# EAGLE design ALU_roll (EAGLE 5.11)
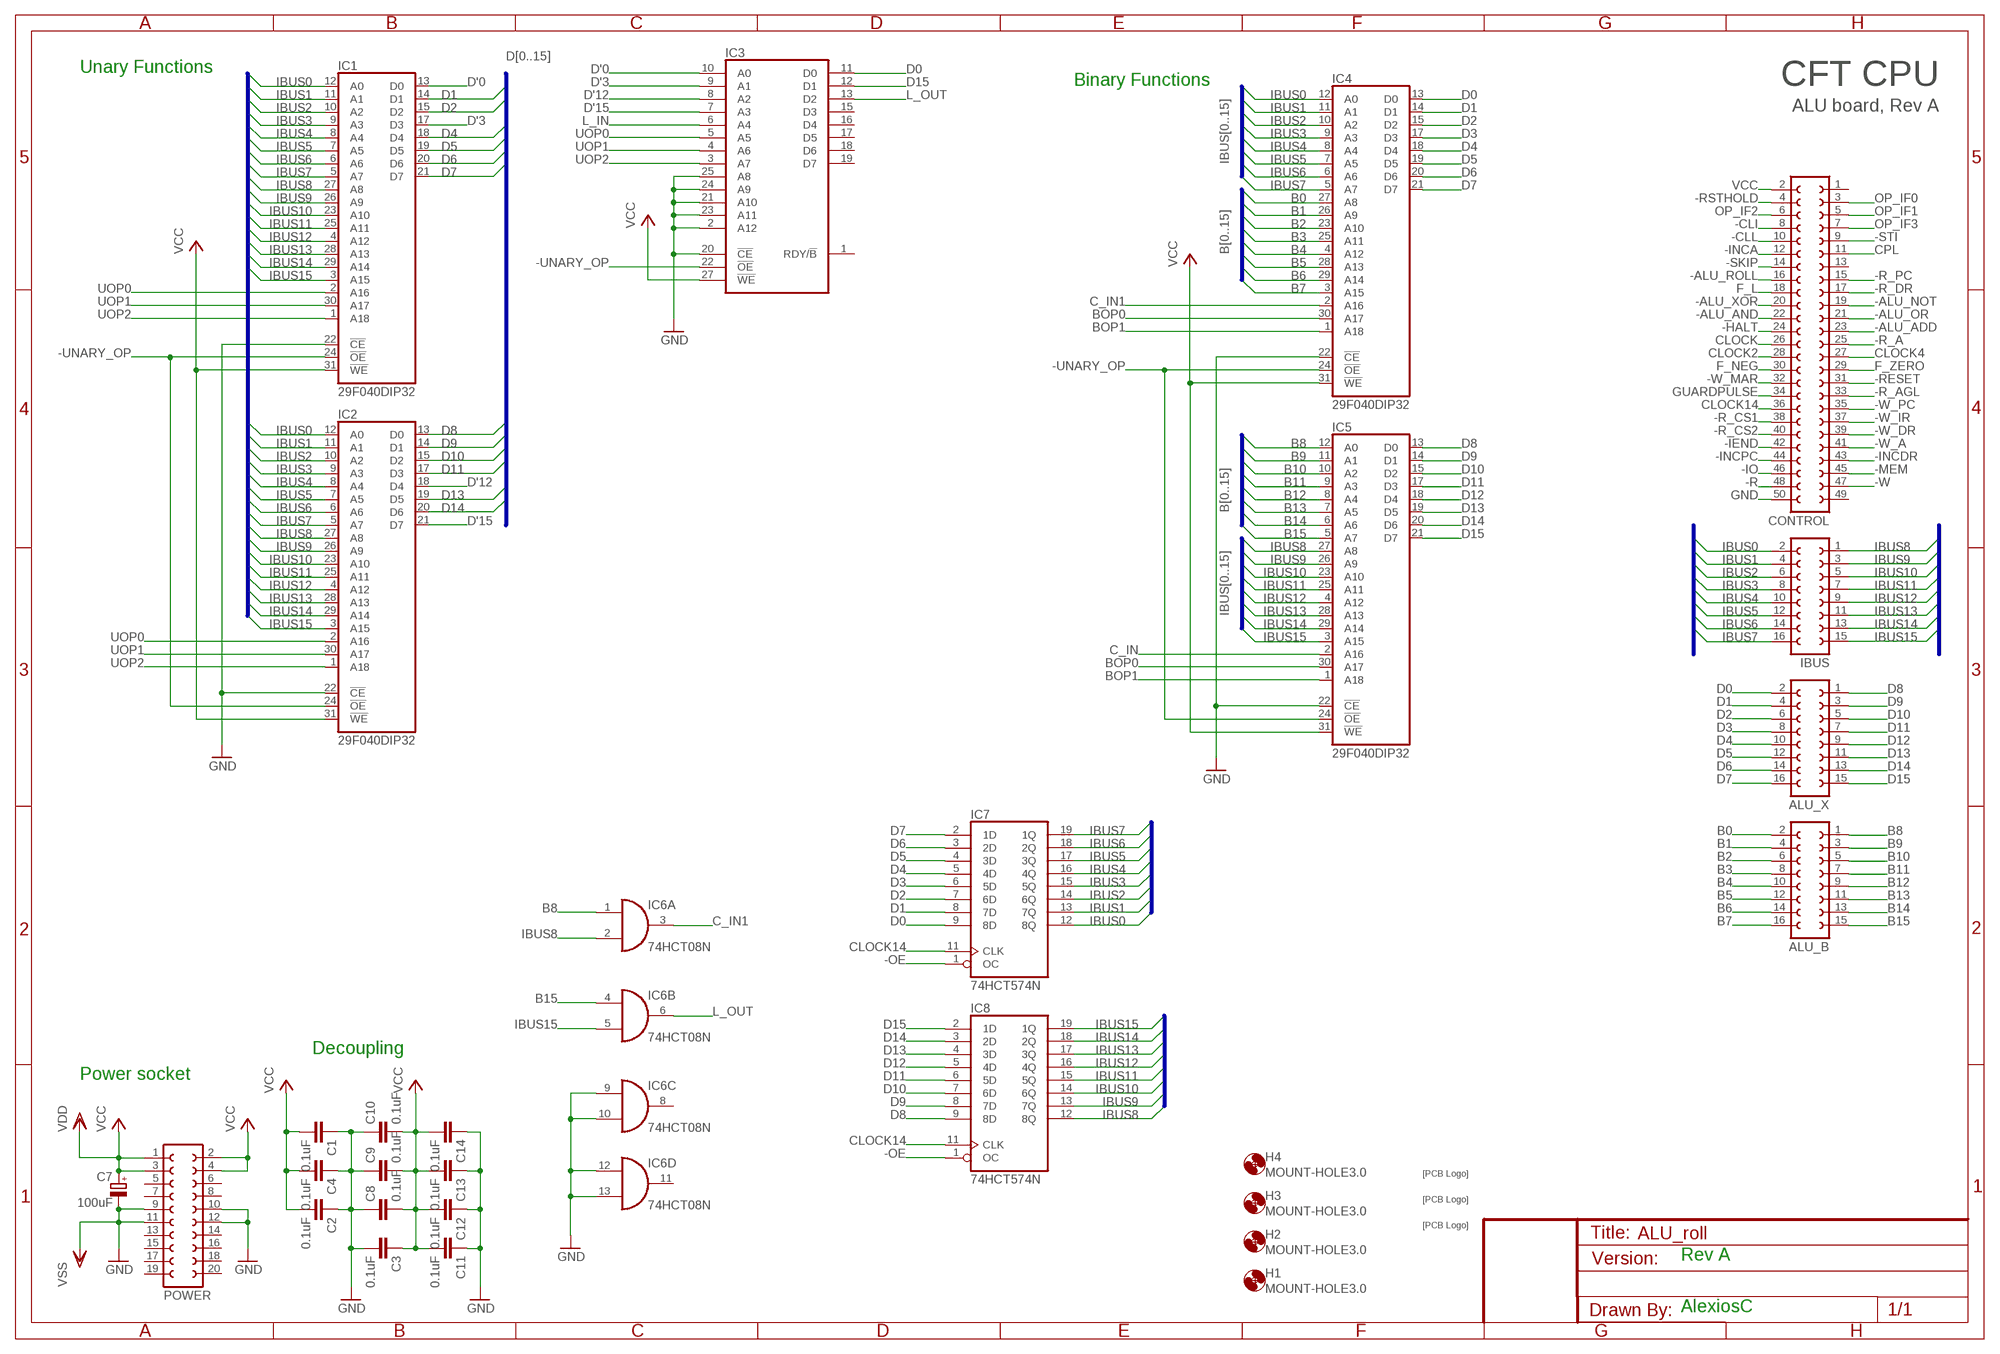
[diagram p0: schematic, sheet 1]

## Parts
ALU_B  FE08-2  [FE08-2]
ALU_X  FE08-2  [FE08-2]
C1  0.1uF  C-EU025-025X050  [C025-025X050]
C2  0.1uF  C-EU025-025X050  [C025-025X050]
C3  0.1uF  C-EU025-025X050  [C025-025X050]
C4  0.1uF  C-EU025-025X050  [C025-025X050]
C7  100uF  CPOL-EUE2.5-6  [E2,5-6]
C8  0.1uF  C-EU025-025X050  [C025-025X050]
C9  0.1uF  C-EU025-025X050  [C025-025X050]
C10  0.1uF  C-EU025-025X050  [C025-025X050]
C11  0.1uF  C-EU025-025X050  [C025-025X050]
C12  0.1uF  C-EU025-025X050  [C025-025X050]
C13  0.1uF  C-EU025-025X050  [C025-025X050]
C14  0.1uF  C-EU025-025X050  [C025-025X050]
CONTROL  FE25-2  [FE25-2]
H1  MOUNT-HOLE3.0  [3,0]
H2  MOUNT-HOLE3.0  [3,0]
H3  MOUNT-HOLE3.0  [3,0]
H4  MOUNT-HOLE3.0  [3,0]
IBUS  FE08-2  [FE08-2]
IC1  29F040DIP32  [DIL32]
IC2  29F040DIP32  [DIL32]
IC3  2864  [DIL28]
IC4  29F040DIP32  [DIL32]
IC5  29F040DIP32  [DIL32]
IC6  74HCT08N  [DIL14]
IC7  74HCT574N  [DIL20]
IC8  74HCT574N  [DIL20]
POWER  FE10-2  [FE10-2]
U$1  SIGNATUREPLANE  [SIGNATURE_PLANE]
U$2  SIGNATUREPLANE  [SIGNATURE_PLANE]
U$3  SIGNATURESILK  [SIGNATURE]

## Nets
-ALU_ADD: CONTROL.23
-ALU_AND: CONTROL.22
-ALU_NOT: CONTROL.19
-ALU_OR: CONTROL.21
-ALU_ROLL: CONTROL.16
-ALU_XOR: CONTROL.20
-CLI: CONTROL.8
-CLL: CONTROL.10
-HALT: CONTROL.24
-IEND: CONTROL.42
-INCA: CONTROL.12
-INCDR: CONTROL.43
-INCPC: CONTROL.44
-IO: CONTROL.46
-MEM: CONTROL.45
-OE: IC7.1(OC) IC8.1(OC)
-R: CONTROL.48
-R_A: CONTROL.25
-R_AGL: CONTROL.33
-R_CS1: CONTROL.38
-R_CS2: CONTROL.40
-R_DR: CONTROL.17
-R_PC: CONTROL.15
-RESET: CONTROL.31
-RSTHOLD: CONTROL.4
-SKIP: CONTROL.14
-STI: CONTROL.9
-UNARY_OP: IC1.24(!OE) IC2.24(!OE) IC3.22(!OE) IC4.24(!OE) IC5.24(!OE)
-W: CONTROL.47
-W_A: CONTROL.41
-W_DR: CONTROL.39
-W_IR: CONTROL.37
-W_MAR: CONTROL.32
-W_PC: CONTROL.35
B0: ALU_B.2 IC4.27(A8)
B1: ALU_B.4 IC4.26(A9)
B2: ALU_B.6 IC4.23(A10)
B3: ALU_B.8 IC4.25(A11)
B4: ALU_B.10 IC4.4(A12)
B5: ALU_B.12 IC4.28(A13)
B6: ALU_B.14 IC4.29(A14)
B7: ALU_B.16 IC4.3(A15)
B8: ALU_B.1 IC5.12(A0) IC6.1(A:I0)
B9: ALU_B.3 IC5.11(A1)
B10: ALU_B.5 IC5.10(A2)
B11: ALU_B.7 IC5.9(A3)
B12: ALU_B.9 IC5.8(A4)
B13: ALU_B.11 IC5.7(A5)
B14: ALU_B.13 IC5.6(A6)
B15: ALU_B.15 IC5.5(A7) IC6.4(B:I0)
BOP0: IC4.30(A17) IC5.30(A17)
BOP1: IC4.1(A18) IC5.1(A18)
C_IN: IC5.2(A16)
C_IN1: IC4.2(A16) IC6.3(A:O)
CLOCK: CONTROL.26
CLOCK2: CONTROL.28
CLOCK4: CONTROL.27
CLOCK14: CONTROL.36 IC7.11(CLK) IC8.11(CLK)
CPL: CONTROL.11
D0: ALU_X.2 IC3.11(D0) IC4.13(D0) IC7.9(8D)
D1: ALU_X.4 IC1.14(D1) IC4.14(D1) IC7.8(7D)
D2: ALU_X.6 IC1.15(D2) IC4.15(D2) IC7.7(6D)
D3: ALU_X.8 IC4.17(D3) IC7.6(5D)
D4: ALU_X.10 IC1.18(D4) IC4.18(D4) IC7.5(4D)
D5: ALU_X.12 IC1.19(D5) IC4.19(D5) IC7.4(3D)
D6: ALU_X.14 IC1.20(D6) IC4.20(D6) IC7.3(2D)
D7: ALU_X.16 IC1.21(D7) IC4.21(D7) IC7.2(1D)
D8: ALU_X.1 IC2.13(D0) IC5.13(D0) IC8.9(8D)
D9: ALU_X.3 IC2.14(D1) IC5.14(D1) IC8.8(7D)
D10: ALU_X.5 IC2.15(D2) IC5.15(D2) IC8.7(6D)
D11: ALU_X.7 IC2.17(D3) IC5.17(D3) IC8.6(5D)
D12: ALU_X.9 IC5.18(D4) IC8.5(4D)
D13: ALU_X.11 IC2.19(D5) IC5.19(D5) IC8.4(3D)
D14: ALU_X.13 IC2.20(D6) IC5.20(D6) IC8.3(2D)
D15: ALU_X.15 IC3.12(D1) IC5.21(D7) IC8.2(1D)
D'0: IC1.13(D0) IC3.10(A0)
D'3: IC1.17(D3) IC3.9(A1)
D'12: IC2.18(D4) IC3.8(A2)
D'15: IC2.21(D7) IC3.7(A3)
F_L: CONTROL.18
F_NEG: CONTROL.30
F_ZERO: CONTROL.29
GND: C1.1 C2.1 C3.2 C4.1 C7.- C8.1 C9.1 C10.1 C11.1 C12.1 C13.1 C14.1 CONTROL.50 IC1.22(!CE) IC2.22(!CE) IC3.2(A12) IC3.20(!CE) IC3.21(A10) IC3.23(A11) IC3.24(A9) IC3.25(A8) IC4.22(!CE) IC5.22(!CE) IC6.9(C:I0) IC6.10(C:I1) IC6.12(D:I0) IC6.13(D:I1) POWER.9 POWER.10 POWER.11 POWER.12 ; supply symbol labelled VSS
GUARDPULSE: CONTROL.34
IBUS0: IBUS.2 IC1.12(A0) IC2.12(A0) IC4.12(A0) IC7.12(8Q)
IBUS1: IBUS.4 IC1.11(A1) IC2.11(A1) IC4.11(A1) IC7.13(7Q)
IBUS2: IBUS.6 IC1.10(A2) IC2.10(A2) IC4.10(A2) IC7.14(6Q)
IBUS3: IBUS.8 IC1.9(A3) IC2.9(A3) IC4.9(A3) IC7.15(5Q)
IBUS4: IBUS.10 IC1.8(A4) IC2.8(A4) IC4.8(A4) IC7.16(4Q)
IBUS5: IBUS.12 IC1.7(A5) IC2.7(A5) IC4.7(A5) IC7.17(3Q)
IBUS6: IBUS.14 IC1.6(A6) IC2.6(A6) IC4.6(A6) IC7.18(2Q)
IBUS7: IBUS.16 IC1.5(A7) IC2.5(A7) IC4.5(A7) IC7.19(1Q)
IBUS8: IBUS.1 IC1.27(A8) IC2.27(A8) IC5.27(A8) IC6.2(A:I1) IC8.12(8Q)
IBUS9: IBUS.3 IC1.26(A9) IC2.26(A9) IC5.26(A9) IC8.13(7Q)
IBUS10: IBUS.5 IC1.23(A10) IC2.23(A10) IC5.23(A10) IC8.14(6Q)
IBUS11: IBUS.7 IC1.25(A11) IC2.25(A11) IC5.25(A11) IC8.15(5Q)
IBUS12: IBUS.9 IC1.4(A12) IC2.4(A12) IC5.4(A12) IC8.16(4Q)
IBUS13: IBUS.11 IC1.28(A13) IC2.28(A13) IC5.28(A13) IC8.17(3Q)
IBUS14: IBUS.13 IC1.29(A14) IC2.29(A14) IC5.29(A14) IC8.18(2Q)
IBUS15: IBUS.15 IC1.3(A15) IC2.3(A15) IC5.3(A15) IC6.5(B:I1) IC8.19(1Q)
L_IN: IC3.6(A4)
L_OUT: IC3.13(D2) IC6.6(B:O)
OP_IF0: CONTROL.3
OP_IF1: CONTROL.5
OP_IF2: CONTROL.6
OP_IF3: CONTROL.7
UOP0: IC1.2(A16) IC2.2(A16) IC3.5(A5)
UOP1: IC1.30(A17) IC2.30(A17) IC3.4(A6)
UOP2: IC1.1(A18) IC2.1(A18) IC3.3(A7)
VCC: C1.2 C2.2 C3.1 C4.2 C7.+ C8.2 C9.2 C10.2 C11.2 C12.2 C13.2 C14.2 CONTROL.2 IC1.31(!WE) IC2.31(!WE) IC3.27(!WE) IC4.31(!WE) IC5.31(!WE) POWER.1 POWER.2 POWER.3 POWER.4 ; supply symbol labelled VDD
Unconnected: CONTROL.1 CONTROL.13 CONTROL.49 IC3.1(RDY/!B) IC3.15(D3) IC3.16(D4) IC3.17(D5) IC3.18(D6) IC3.19(D7) IC6.8(C:O) IC6.11(D:O) POWER.5 POWER.6 POWER.7 POWER.8 POWER.13 POWER.14 POWER.15 POWER.16 POWER.17 POWER.18 POWER.19 POWER.20

## Buses
IBUS[0..15]
D[0..15]
B[0..15]

## Notes on the sheet
- Unary Functions
- Binary Functions | CFT CPU
- ALU board, Rev A
- Decoupling
- Power socket
- Rev A
- AlexiosC

## Power pins joined to a net without a drawn wire
GND: IC1.16(GND) IC2.16(GND) IC3.14(GND) IC4.16(GND) IC5.16(GND) IC6.7(P:GND) IC7.10(GND) IC8.10(GND)
VCC: IC1.32(VCC) IC2.32(VCC) IC3.28(VCC) IC4.32(VCC) IC5.32(VCC) IC6.14(P:VCC) IC7.20(VCC) IC8.20(VCC)

## Library data of the parts
ALU_B ALU_X IBUS = con-lsta:FE08-2: FEMALE HEADER
C1-C4 C8-C14 = rcl:C-EU: CAPACITOR, European symbol
C7 = rcl:CPOL-EU: POLARIZED CAPACITOR, European symbol
CONTROL = con-lsta:FE25-2: FEMALE HEADER
H1-H4 = holes:MOUNT-HOLE: MOUNTING HOLE with drill center marker
IC1 IC2 IC4 IC5 = alexios:29F040: 4-mbit (512x8) Flash memory in a PLCC32 package (with socket). AM29F040 is an example of this.
IC3 = memory:2864: MEMORY
IC6 = 74xx-eu:74*08: Quad 2-input AND gate
IC7 IC8 = 74xx-eu:74*574: 8-bit D type FLIP FLOP bus driver
POWER = con-lsta:FE10-2: FEMALE HEADER; OC_FARNELL: unknown; OC_NEWARK: unknown
U$1-U$3 = alexios:SIGNATURE: Soup signature

## Net classes
1 Decoupling: width 1.27 mm

## Board
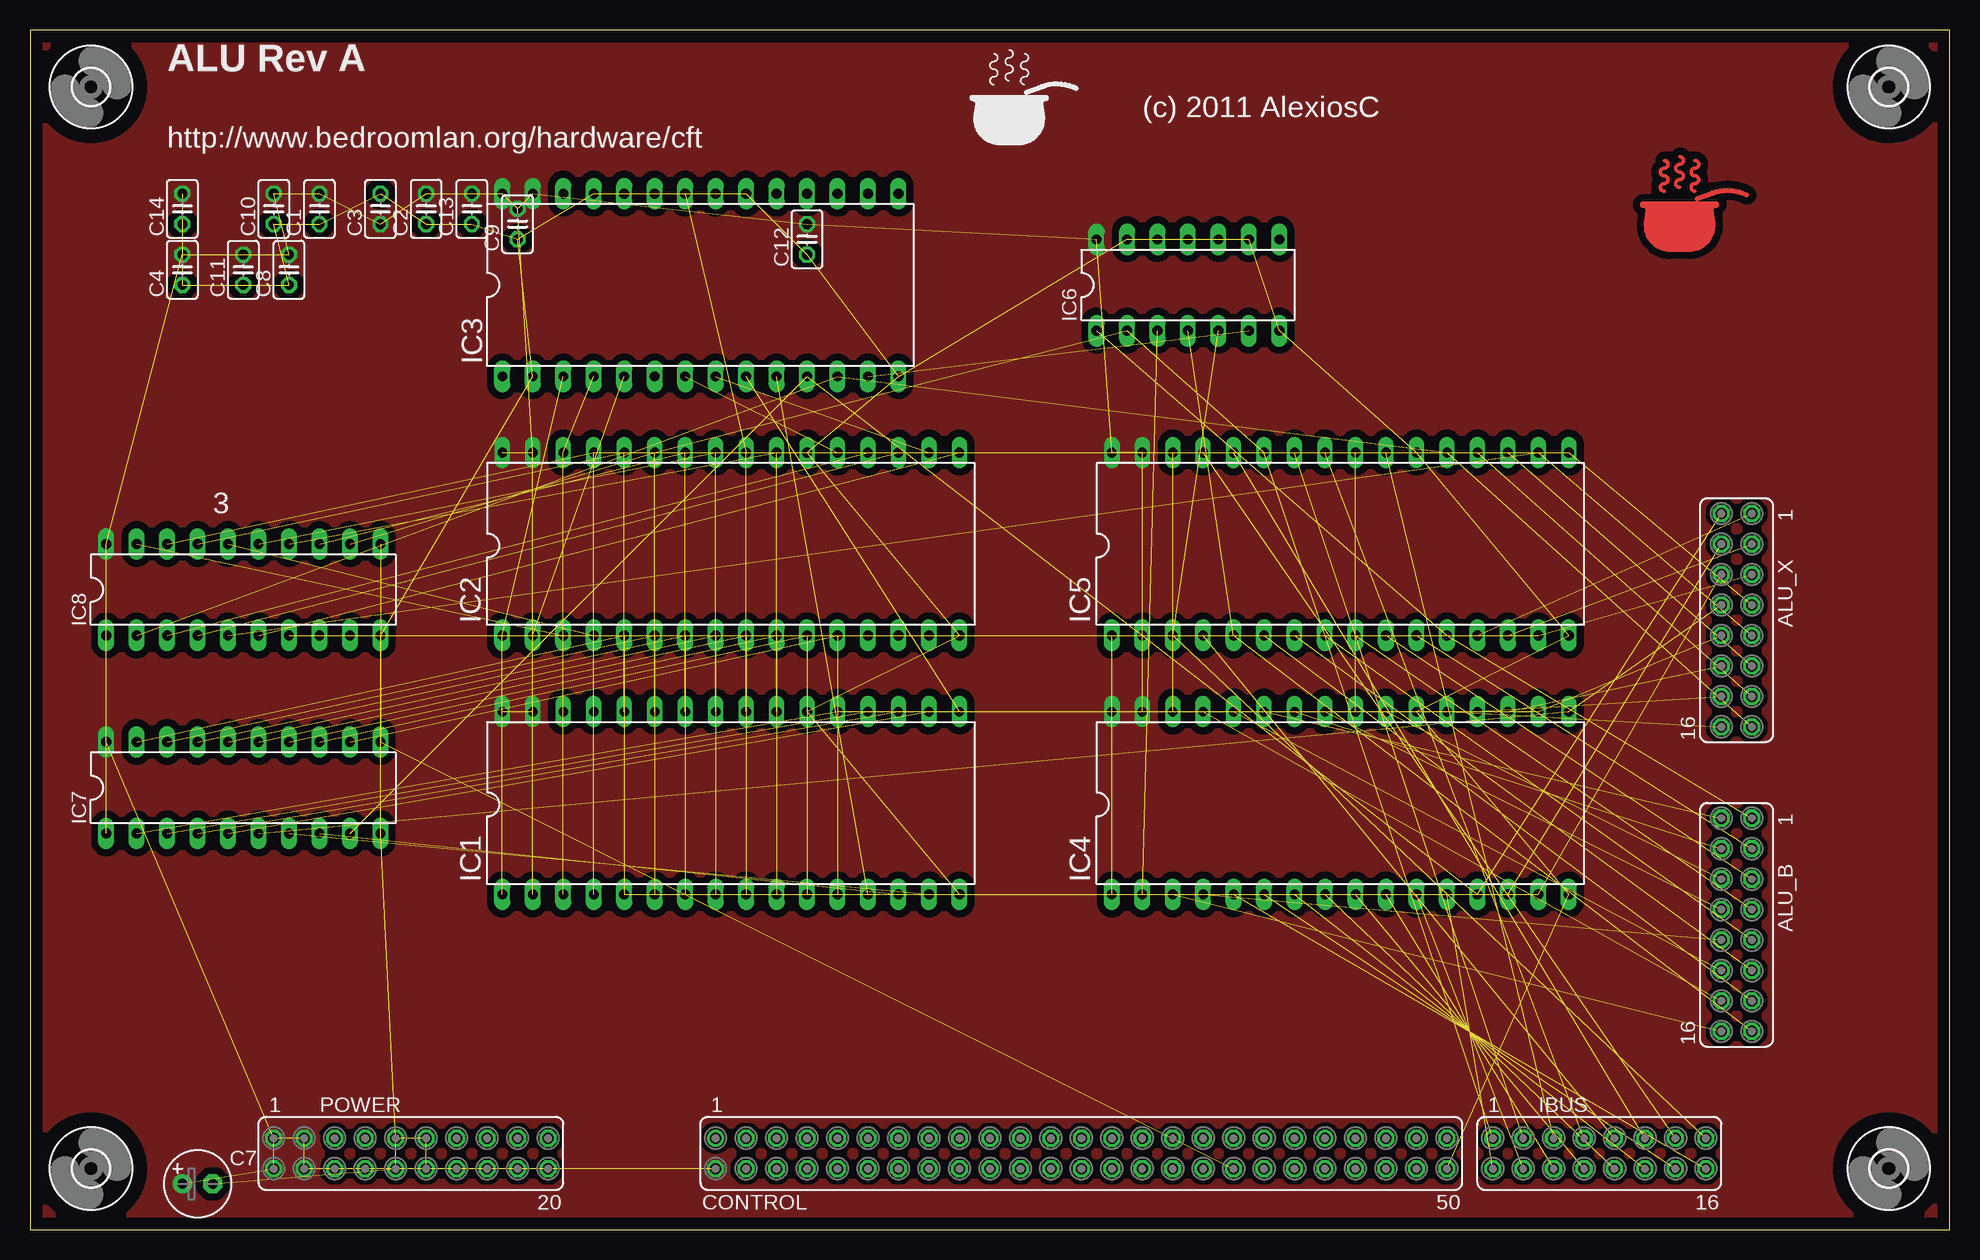
[diagram p1: board, top side]
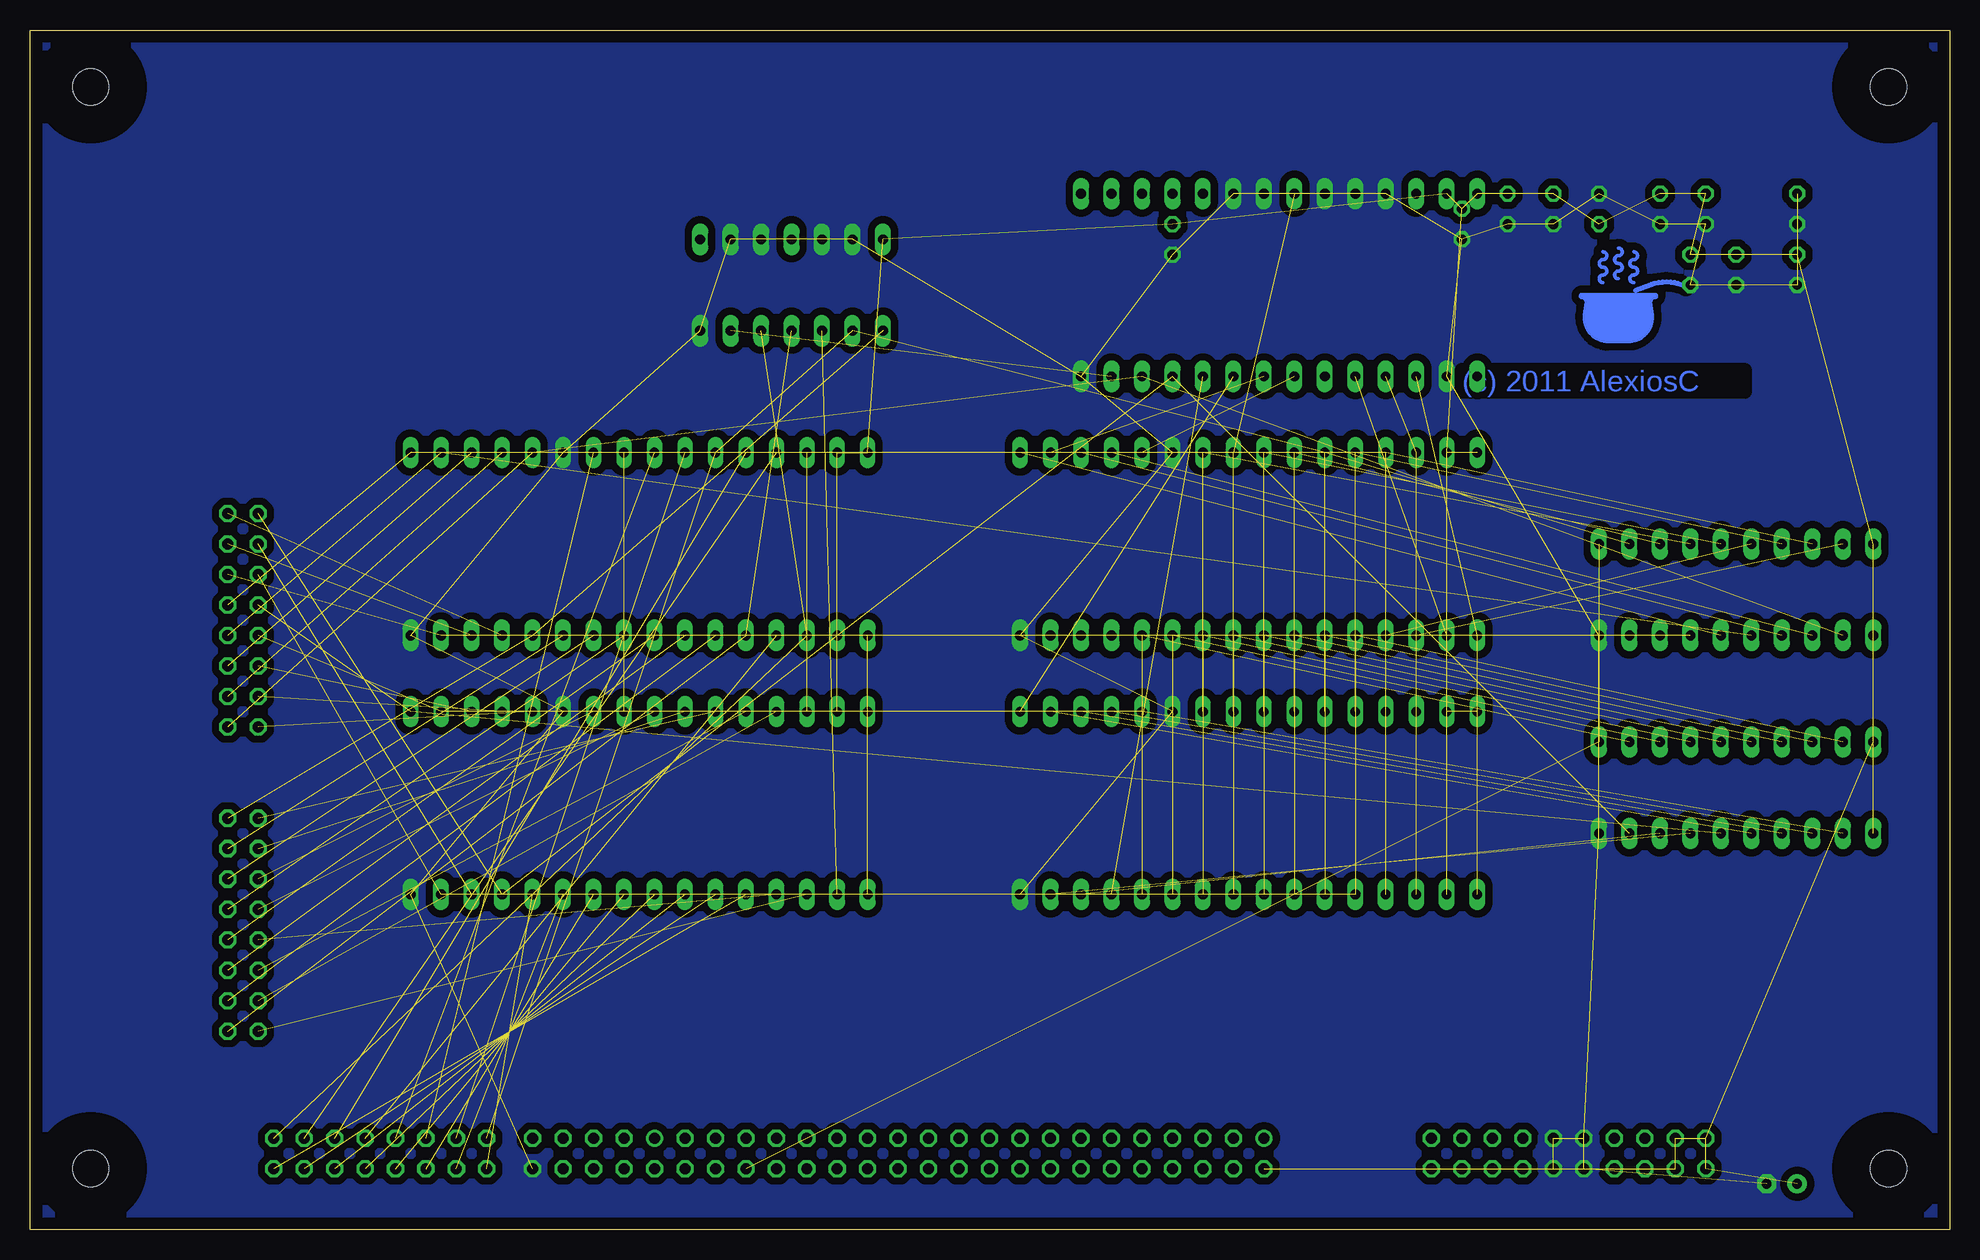
[diagram p2: board, bottom side, seen from below]

Size 160 x 100 mm. Coordinates in mm from the lower left corner, seen from the top.
Outline: 0,0 160,0 160,100 0,100 0,0
Copper layers (1*16): Top 0.035mm / dielectric 1.5mm / Bottom 0.035mm
Design rules "olimex-10mil": minimum track width 10mil, minimum drill 24mil, track to track 10mil, track to pad 10mil, pad to pad 10mil, via to via 10mil, smd to smd 10mil, copper to edge 40mil, drill to drill 10mil, minimum pad ring 10mil, minimum via ring 8mil, stop-mask expansion 0mil, vias tented up to drill 0mil, thermal gap 10mil

### Footprints (pad centres in the part's own frame; a part is rotated, then mirrored left to right if it is on the bottom)
FE08-2 = drill 0.914 octagon: 1 -8.89,1.27; 2 -8.89,-1.27; 3 -6.35,1.27; 4 -6.35,-1.27; 5 -3.81,1.27; 6 -3.81,-1.27; 7 -1.27,1.27; 8 -1.27,-1.27; 9 1.27,1.27; 10 1.27,-1.27; 11 3.81,1.27; 12 3.81,-1.27; 13 6.35,1.27; 14 6.35,-1.27; 15 8.89,1.27; 16 8.89,-1.27
C025-025X050 = drill 0.813 octagon: 1 -1.27,0; 2 1.27,0
E2,5-6 = drill 0.813 pad 1.6 round: + -1.27,0 | drill 0.813 pad 1.6 octagon: - 1.27,0
FE25-2 = drill 0.914 round: 1 -30.48,1.27; 41 20.32,1.27 | drill 0.914 octagon: 2 -30.48,-1.27; 3 -27.94,1.27; 4 -27.94,-1.27; 5 -25.4,1.27; 6 -25.4,-1.27; 7 -22.86,1.27; 8 -22.86,-1.27; 9 -20.32,1.27; 10 -20.32,-1.27; 11 -17.78,1.27; 12 -17.78,-1.27; 13 -15.24,1.27; 14 -15.24,-1.27; 15 -12.7,1.27; 16 -12.7,-1.27; 17 -10.16,1.27; 18 -10.16,-1.27; 19 -7.62,1.27; 20 -7.62,-1.27; 21 -5.08,1.27; 22 -5.08,-1.27; 23 -2.54,1.27; 24 -2.54,-1.27; 25 0,1.27; 26 0,-1.27; 27 2.54,1.27; 28 2.54,-1.27; 29 5.08,1.27; 30 5.08,-1.27; 31 7.62,1.27; 32 7.62,-1.27; 33 10.16,1.27; 34 10.16,-1.27; 35 12.7,1.27; 36 12.7,-1.27; 37 15.24,1.27; 38 15.24,-1.27; 39 17.78,1.27; 40 17.78,-1.27; 42 20.32,-1.27; 43 22.86,1.27; 44 22.86,-1.27; 45 25.4,1.27; 46 25.4,-1.27; 47 27.94,1.27; 48 27.94,-1.27; 49 30.48,1.27; 50 30.48,-1.27
3,0 = hole 3: 0,0
DIL32 = drill 0.813 long: 1 -19.05,-7.62; 2 -16.51,-7.62; 3 -13.97,-7.62; 4 -11.43,-7.62; 5 -8.89,-7.62; 6 -6.35,-7.62; 7 -3.81,-7.62; 8 -1.27,-7.62; 9 1.27,-7.62; 10 3.81,-7.62; 11 6.35,-7.62; 12 8.89,-7.62; 13 11.43,-7.62; 14 13.97,-7.62; 15 16.51,-7.62; 16 19.05,-7.62 | drill 0.8 long: 17 19.05,7.62; 18 16.51,7.62; 19 13.97,7.62; 20 11.43,7.62; 21 8.89,7.62; 22 6.35,7.62; 23 3.81,7.62; 24 1.27,7.62; 25 -1.27,7.62; 26 -3.81,7.62; 27 -6.35,7.62; 28 -8.89,7.62; 29 -11.43,7.62; 30 -13.97,7.62; 31 -16.51,7.62; 32 -19.05,7.62
DIL28 = drill 0.813 long: 1 -16.51,-7.62; 2 -13.97,-7.62; 3 -11.43,-7.62; 4 -8.89,-7.62; 5 -6.35,-7.62; 6 -3.81,-7.62; 7 -1.27,-7.62; 8 1.27,-7.62; 9 3.81,-7.62; 10 6.35,-7.62; 11 8.89,-7.62; 12 11.43,-7.62; 13 13.97,-7.62; 14 16.51,-7.62; 15 16.51,7.62; 16 13.97,7.62; 17 11.43,7.62; 18 8.89,7.62; 19 6.35,7.62; 20 3.81,7.62; 21 1.27,7.62; 22 -1.27,7.62; 23 -3.81,7.62; 24 -6.35,7.62; 25 -8.89,7.62; 26 -11.43,7.62; 27 -13.97,7.62; 28 -16.51,7.62
DIL14 = drill 0.813 long: 1 -7.62,-3.81; 2 -5.08,-3.81; 3 -2.54,-3.81; 4 0,-3.81; 5 2.54,-3.81; 6 5.08,-3.81; 7 7.62,-3.81; 8 7.62,3.81; 9 5.08,3.81; 10 2.54,3.81; 11 0,3.81; 12 -2.54,3.81; 13 -5.08,3.81; 14 -7.62,3.81
DIL20 = drill 0.813 long: 1 -11.43,-3.81; 2 -8.89,-3.81; 3 -6.35,-3.81; 4 -3.81,-3.81; 5 -1.27,-3.81; 6 1.27,-3.81; 7 3.81,-3.81; 8 6.35,-3.81; 9 8.89,-3.81; 10 11.43,-3.81; 11 11.43,3.81; 12 8.89,3.81; 13 6.35,3.81; 14 3.81,3.81; 15 1.27,3.81; 16 -1.27,3.81; 17 -3.81,3.81; 18 -6.35,3.81; 19 -8.89,3.81; 20 -11.43,3.81
FE10-2 = drill 0.914 octagon: 1 -11.43,1.27; 2 -11.43,-1.27; 3 -8.89,1.27; 4 -8.89,-1.27; 5 -6.35,1.27; 6 -6.35,-1.27; 7 -3.81,1.27; 8 -3.81,-1.27; 9 -1.27,1.27; 10 -1.27,-1.27; 11 1.27,1.27; 12 1.27,-1.27; 13 3.81,1.27; 14 3.81,-1.27; 15 6.35,1.27; 16 6.35,-1.27; 17 8.89,1.27; 18 8.89,-1.27; 19 11.43,1.27; 20 11.43,-1.27

### Placement (x,y rotation side)
ALU_B  142.24,25.4 270 top
ALU_X  142.24,50.8 270 top
C1  24.13,85.09 90 top
C2  33.02,85.09 90 top
C3  29.21,85.09 90 top
C4  12.7,80.01 90 top
C7  13.97,3.81 0 top
C8  21.59,80.01 90 top
C9  40.64,83.82 90 top
C10  20.32,85.09 90 top
C11  17.78,80.01 90 top
C12  64.77,82.55 90 top
C13  36.83,85.09 90 top
C14  12.7,85.09 90 top
CONTROL  87.63,6.35 0 top
H1  154.94,95.25 0 top
H2  154.94,5.08 0 top
H3  5.08,5.08 0 top
H4  5.08,95.25 0 top
IBUS  130.81,6.35 0 top
IC1  58.42,35.56 0 top
IC2  58.42,57.15 0 top
IC3  55.88,78.74 0 top
IC4  109.22,35.56 0 top
IC5  109.22,57.15 0 top
IC6  96.52,78.74 0 top
IC7  17.78,36.83 0 top
IC8  17.78,53.34 0 top
POWER  31.75,6.35 0 top
U$1  134.62,81.28 0 top
U$2  30.48,73.66 0 bottom
U$3  78.74,90.17 0 top

### Tracks (layer width: path | path; a pad name or v marks a point on that pad's centre or on a via)
-OE  (1 unrouted)
-UNARY_OP  (4 unrouted)
B0  (1 unrouted)
B1  (1 unrouted)
B2  (1 unrouted)
B3  (1 unrouted)
B4  (1 unrouted)
B5  (1 unrouted)
B6  (1 unrouted)
B7  (1 unrouted)
B8  (2 unrouted)
B9  (1 unrouted)
B10  (1 unrouted)
B11  (1 unrouted)
B12  (1 unrouted)
B13  (1 unrouted)
B14  (1 unrouted)
B15  (2 unrouted)
BOP0  (1 unrouted)
BOP1  (1 unrouted)
C_IN1  (1 unrouted)
CLOCK14  (2 unrouted)
D0  (3 unrouted)
D1  (3 unrouted)
D2  (3 unrouted)
D3  (2 unrouted)
D4  (3 unrouted)
D5  (3 unrouted)
D6  (3 unrouted)
D7  (3 unrouted)
D8  (3 unrouted)
D9  (3 unrouted)
D10  (3 unrouted)
D11  (3 unrouted)
D12  (2 unrouted)
D13  (3 unrouted)
D14  (3 unrouted)
D15  (3 unrouted)
D'0  (1 unrouted)
D'3  (1 unrouted)
D'12  (1 unrouted)
D'15  (1 unrouted)
GND  (38 unrouted)
  pour Bottom (isolate 0.508, no thermals): 30.48,8.89 29.21,7.62 29.21,5.08 30.48,3.81 33.02,3.81 34.29,5.08 34.29,7.62 33.02,8.89
  pour Bottom (isolate 0.61, no thermals): 0,100.33 0,0 160.02,0 160.02,100.33
IBUS0  (4 unrouted)
IBUS1  (4 unrouted)
IBUS2  (4 unrouted)
IBUS3  (4 unrouted)
IBUS4  (4 unrouted)
IBUS5  (4 unrouted)
IBUS6  (4 unrouted)
IBUS7  (4 unrouted)
IBUS8  (5 unrouted)
IBUS9  (4 unrouted)
IBUS10  (4 unrouted)
IBUS11  (4 unrouted)
IBUS12  (4 unrouted)
IBUS13  (4 unrouted)
IBUS14  (4 unrouted)
IBUS15  (5 unrouted)
L_OUT  (1 unrouted)
UOP0  (2 unrouted)
UOP1  (2 unrouted)
UOP2  (2 unrouted)
VCC  (29 unrouted)
  pour Top (isolate 0.508, no thermals): 20.32,8.89 19.05,7.62 19.05,5.08 20.32,3.81 22.86,3.81 24.13,5.08 24.13,7.62 22.86,8.89
  pour Top (isolate 0.61, rank 6, no thermals): 0,100.33 0,0 160.02,0 160.02,100.33

### Text on the board
Bottom: (c) 2011 AlexiosC
tNames: ALU Rev A | (c) 2011 AlexiosC | http://www.bedroomlan.org/hardware/cft | 3
tValues: +12V | +5V | GND